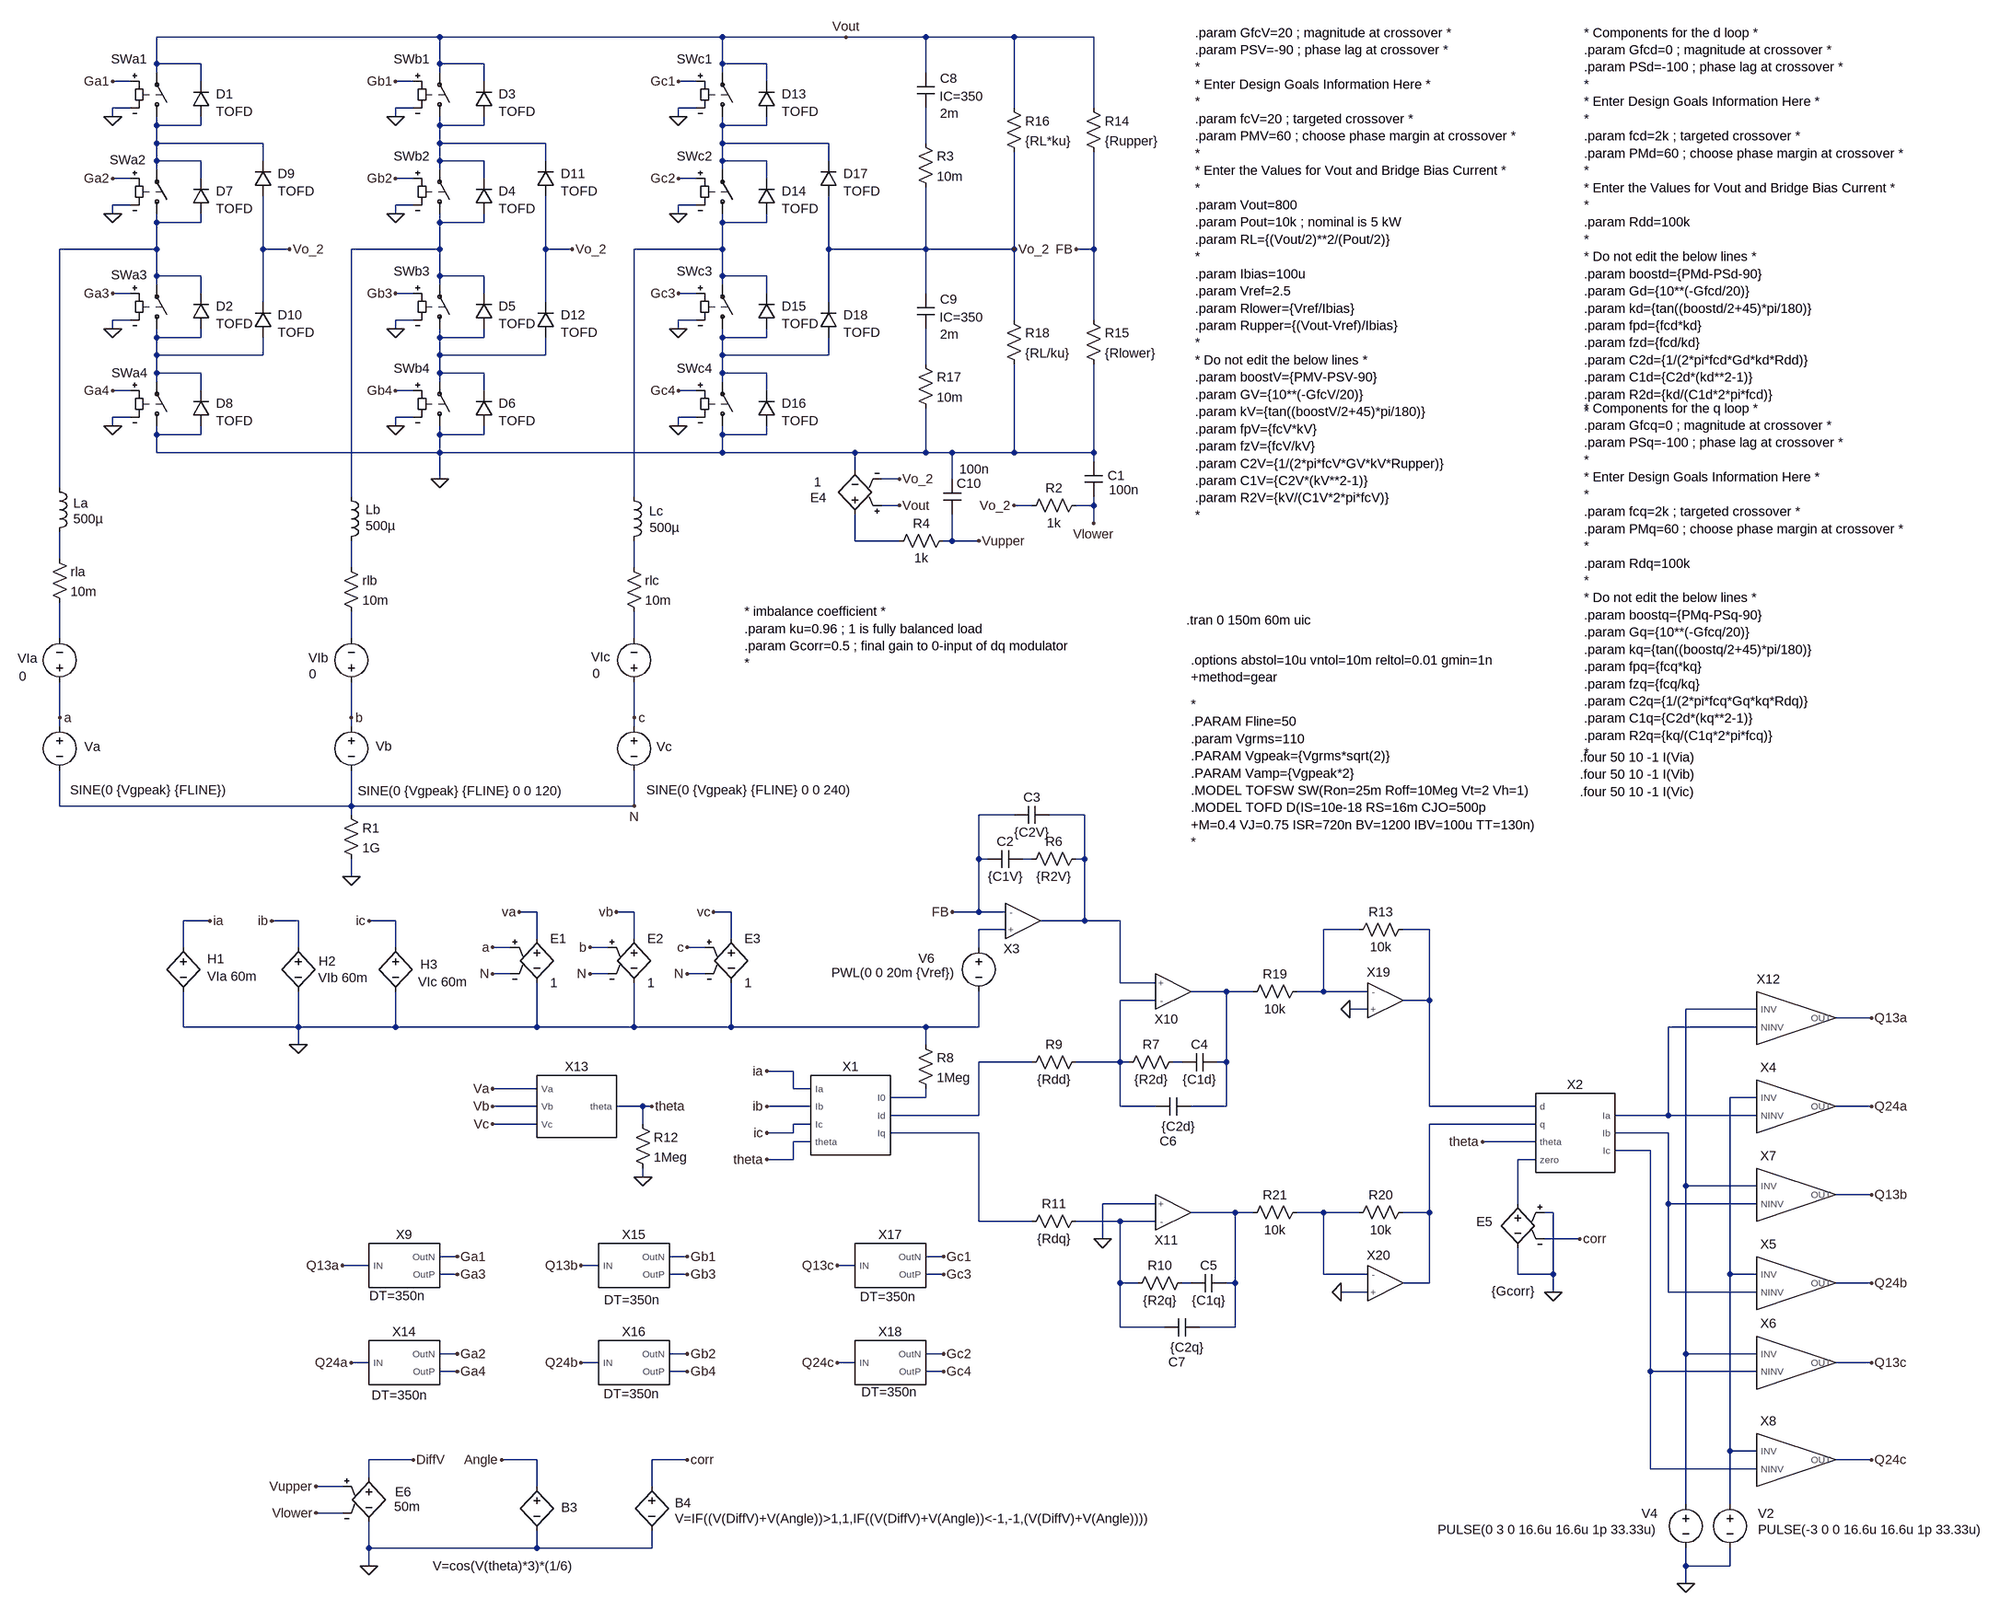
[diagram p0: schematic 3-phase NPC PFC with switches - balanced outputs.asc]
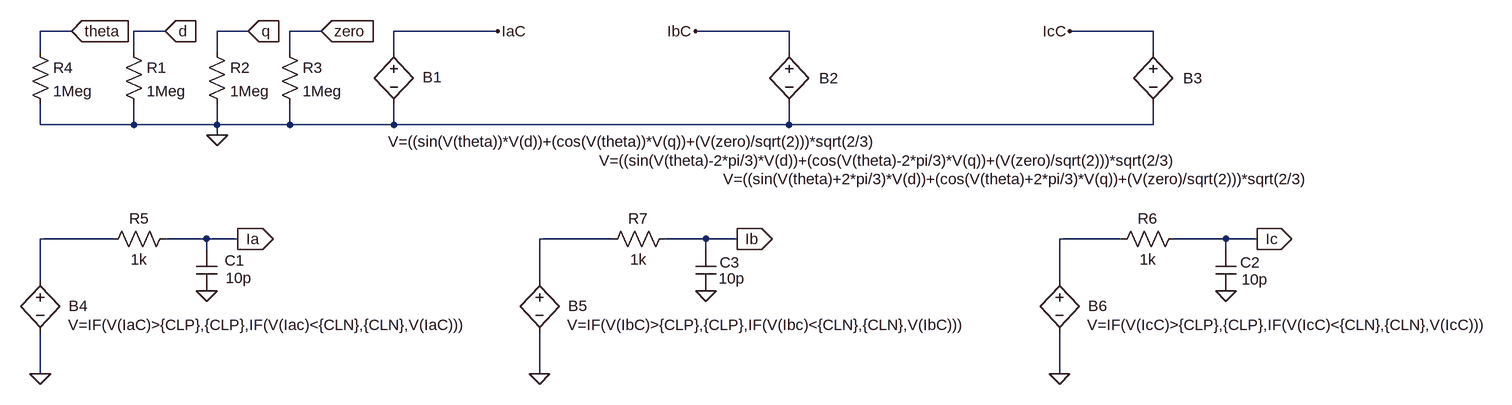
[diagram p1: sub-circuit inverse_dq0.asc]
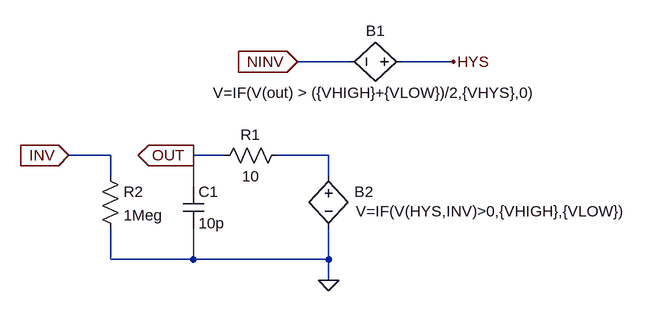
[diagram p2: sub-circuit comptof.asc]
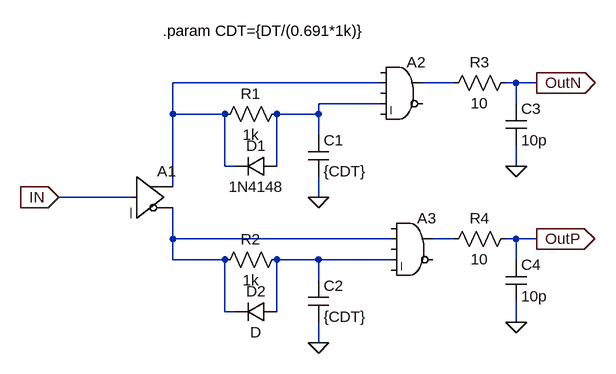
[diagram p3: sub-circuit dt_driver.asc]
3-phase NPC PFC with switches - balanced outputs.asc, the LTspice schematic file:
Version 4.1
SHEET 1 4820 2124
WIRE 496 -1056 -16 -1056
WIRE 1008 -1056 496 -1056
WIRE 1232 -1056 1008 -1056
WIRE 1376 -1056 1232 -1056
WIRE 1536 -1056 1376 -1056
WIRE 1680 -1056 1536 -1056
WIRE -16 -1008 -16 -1056
WIRE 64 -1008 -16 -1008
WIRE 496 -1008 496 -1056
WIRE 576 -1008 496 -1008
WIRE 1008 -1008 1008 -1056
WIRE 1088 -1008 1008 -1008
WIRE -16 -992 -16 -1008
WIRE 496 -992 496 -1008
WIRE 1008 -992 1008 -1008
WIRE 1376 -992 1376 -1056
WIRE -64 -976 -96 -976
WIRE 64 -976 64 -1008
WIRE 448 -976 416 -976
WIRE 576 -976 576 -1008
WIRE 960 -976 928 -976
WIRE 1088 -976 1088 -1008
WIRE -64 -928 -96 -928
WIRE 448 -928 416 -928
WIRE 960 -928 928 -928
WIRE 1536 -928 1536 -1056
WIRE 1680 -928 1680 -1056
WIRE -96 -912 -96 -928
WIRE 416 -912 416 -928
WIRE 928 -912 928 -928
WIRE -16 -896 -16 -912
WIRE 64 -896 64 -912
WIRE 64 -896 -16 -896
WIRE 496 -896 496 -912
WIRE 576 -896 576 -912
WIRE 576 -896 496 -896
WIRE 1008 -896 1008 -912
WIRE 1088 -896 1088 -912
WIRE 1088 -896 1008 -896
WIRE -16 -864 -16 -896
WIRE 176 -864 -16 -864
WIRE 496 -864 496 -896
WIRE 688 -864 496 -864
WIRE 1008 -864 1008 -896
WIRE 1200 -864 1008 -864
WIRE 1376 -864 1376 -928
WIRE -16 -832 -16 -864
WIRE 64 -832 -16 -832
WIRE 176 -832 176 -864
WIRE 496 -832 496 -864
WIRE 576 -832 496 -832
WIRE 688 -832 688 -864
WIRE 1008 -832 1008 -864
WIRE 1088 -832 1008 -832
WIRE 1200 -832 1200 -864
WIRE -16 -816 -16 -832
WIRE 496 -816 496 -832
WIRE 1008 -816 1008 -832
WIRE -64 -800 -96 -800
WIRE 64 -800 64 -832
WIRE 448 -800 416 -800
WIRE 576 -800 576 -832
WIRE 960 -800 928 -800
WIRE 1088 -800 1088 -832
WIRE -64 -752 -96 -752
WIRE 448 -752 416 -752
WIRE 960 -752 928 -752
WIRE -96 -736 -96 -752
WIRE 416 -736 416 -752
WIRE 928 -736 928 -752
WIRE -16 -720 -16 -736
WIRE 64 -720 64 -736
WIRE 64 -720 -16 -720
WIRE 496 -720 496 -736
WIRE 576 -720 576 -736
WIRE 576 -720 496 -720
WIRE 1008 -720 1008 -736
WIRE 1088 -720 1088 -736
WIRE 1088 -720 1008 -720
WIRE -16 -672 -16 -720
WIRE -16 -672 -192 -672
WIRE 176 -672 176 -768
WIRE 224 -672 176 -672
WIRE 496 -672 496 -720
WIRE 496 -672 336 -672
WIRE 688 -672 688 -768
WIRE 736 -672 688 -672
WIRE 1008 -672 1008 -720
WIRE 1008 -672 848 -672
WIRE 1200 -672 1200 -768
WIRE 1376 -672 1376 -784
WIRE 1376 -672 1200 -672
WIRE 1536 -672 1536 -848
WIRE 1536 -672 1376 -672
WIRE 1680 -672 1680 -848
WIRE 1680 -672 1648 -672
WIRE -16 -624 -16 -672
WIRE 64 -624 -16 -624
WIRE 496 -624 496 -672
WIRE 576 -624 496 -624
WIRE 1008 -624 1008 -672
WIRE 1088 -624 1008 -624
WIRE -16 -608 -16 -624
WIRE 496 -608 496 -624
WIRE 1008 -608 1008 -624
WIRE -64 -592 -96 -592
WIRE 64 -592 64 -624
WIRE 448 -592 416 -592
WIRE 576 -592 576 -624
WIRE 960 -592 928 -592
WIRE 1088 -592 1088 -624
WIRE 1376 -592 1376 -672
WIRE 176 -576 176 -672
WIRE 688 -576 688 -672
WIRE 1200 -576 1200 -672
WIRE -64 -544 -96 -544
WIRE 448 -544 416 -544
WIRE 960 -544 928 -544
WIRE 1536 -544 1536 -672
WIRE 1680 -544 1680 -672
WIRE -96 -528 -96 -544
WIRE 416 -528 416 -544
WIRE 928 -528 928 -544
WIRE -16 -512 -16 -528
WIRE 64 -512 64 -528
WIRE 64 -512 -16 -512
WIRE 496 -512 496 -528
WIRE 576 -512 576 -528
WIRE 576 -512 496 -512
WIRE 1008 -512 1008 -528
WIRE 1088 -512 1088 -528
WIRE 1088 -512 1008 -512
WIRE -16 -480 -16 -512
WIRE 176 -480 176 -512
WIRE 176 -480 -16 -480
WIRE 496 -480 496 -512
WIRE 688 -480 688 -512
WIRE 688 -480 496 -480
WIRE 1008 -480 1008 -512
WIRE 1200 -480 1200 -512
WIRE 1200 -480 1008 -480
WIRE 1376 -464 1376 -528
WIRE -16 -448 -16 -480
WIRE 64 -448 -16 -448
WIRE 496 -448 496 -480
WIRE 576 -448 496 -448
WIRE 1008 -448 1008 -480
WIRE 1088 -448 1008 -448
WIRE -16 -432 -16 -448
WIRE 496 -432 496 -448
WIRE 1008 -432 1008 -448
WIRE -64 -416 -96 -416
WIRE 64 -416 64 -448
WIRE 448 -416 416 -416
WIRE 576 -416 576 -448
WIRE 960 -416 928 -416
WIRE 1088 -416 1088 -448
WIRE -64 -368 -96 -368
WIRE 448 -368 416 -368
WIRE 960 -368 928 -368
WIRE -96 -352 -96 -368
WIRE 416 -352 416 -368
WIRE 928 -352 928 -368
WIRE -16 -336 -16 -352
WIRE 64 -336 64 -352
WIRE 64 -336 -16 -336
WIRE 496 -336 496 -352
WIRE 576 -336 576 -352
WIRE 576 -336 496 -336
WIRE 1008 -336 1008 -352
WIRE 1088 -336 1088 -352
WIRE 1088 -336 1008 -336
WIRE -16 -304 -16 -336
WIRE 496 -304 496 -336
WIRE 496 -304 -16 -304
WIRE 1008 -304 1008 -336
WIRE 1008 -304 496 -304
WIRE 1248 -304 1008 -304
WIRE 1376 -304 1376 -384
WIRE 1376 -304 1248 -304
WIRE 1424 -304 1376 -304
WIRE 1536 -304 1536 -464
WIRE 1536 -304 1424 -304
WIRE 1680 -304 1680 -464
WIRE 1680 -304 1536 -304
WIRE 1680 -288 1680 -304
WIRE 1248 -272 1248 -304
WIRE 496 -256 496 -304
WIRE 1328 -256 1296 -256
WIRE 1424 -256 1424 -304
WIRE -192 -240 -192 -672
WIRE 336 -224 336 -672
WIRE 848 -224 848 -672
WIRE 1328 -208 1296 -208
WIRE 1568 -208 1536 -208
WIRE 1680 -208 1680 -224
WIRE 1680 -208 1648 -208
WIRE 1680 -176 1680 -208
WIRE 1248 -144 1248 -192
WIRE 1328 -144 1248 -144
WIRE 1424 -144 1424 -192
WIRE 1424 -144 1408 -144
WIRE 1472 -144 1424 -144
WIRE -192 -112 -192 -160
WIRE 336 -96 336 -144
WIRE 848 -96 848 -144
WIRE -192 32 -192 -32
WIRE 336 32 336 -16
WIRE 848 32 848 -16
WIRE -192 176 -192 112
WIRE 336 176 336 112
WIRE 848 176 848 112
WIRE -192 192 -192 176
WIRE 336 192 336 176
WIRE 848 192 848 176
WIRE -192 336 -192 272
WIRE 336 336 336 272
WIRE 336 336 -192 336
WIRE 848 336 848 272
WIRE 848 336 336 336
WIRE 336 352 336 336
WIRE 1536 352 1472 352
WIRE 1664 352 1600 352
WIRE 1472 432 1472 352
WIRE 1488 432 1472 432
WIRE 1568 432 1552 432
WIRE 1664 432 1664 352
WIRE 1664 432 1648 432
WIRE 336 464 336 432
WIRE 672 528 640 528
WIRE 848 528 816 528
WIRE 1024 528 992 528
WIRE 1472 528 1472 432
WIRE 1472 528 1424 528
WIRE 1520 528 1472 528
WIRE 80 544 32 544
WIRE 240 544 192 544
WIRE 416 544 368 544
WIRE 1664 544 1664 432
WIRE 1664 544 1584 544
WIRE 1728 544 1664 544
WIRE 1520 560 1472 560
WIRE 2160 560 2096 560
WIRE 2288 560 2240 560
WIRE 672 576 672 528
WIRE 848 576 848 528
WIRE 1024 576 1024 528
WIRE 32 592 32 544
WIRE 240 592 240 544
WIRE 416 592 416 544
WIRE 624 592 592 592
WIRE 800 592 768 592
WIRE 976 592 944 592
WIRE 1472 592 1472 560
WIRE 624 640 592 640
WIRE 800 640 768 640
WIRE 976 640 944 640
WIRE 1728 656 1728 544
WIRE 1792 656 1728 656
WIRE 1920 672 1856 672
WIRE 1968 672 1920 672
WIRE 2096 672 2096 560
WIRE 2096 672 2048 672
WIRE 2176 672 2096 672
WIRE 1792 688 1728 688
WIRE 2288 688 2288 560
WIRE 2288 688 2240 688
WIRE 2176 704 2144 704
WIRE 2880 704 2752 704
WIRE 3088 720 3024 720
WIRE 32 736 32 672
WIRE 240 736 240 672
WIRE 240 736 32 736
WIRE 416 736 416 672
WIRE 416 736 240 736
WIRE 672 736 672 656
WIRE 672 736 416 736
WIRE 848 736 848 656
WIRE 848 736 672 736
WIRE 1024 736 1024 656
WIRE 1024 736 848 736
WIRE 1376 736 1024 736
WIRE 1472 736 1472 672
WIRE 1472 736 1376 736
WIRE 2880 736 2720 736
WIRE 240 768 240 736
WIRE 1376 768 1376 736
WIRE 1568 800 1472 800
WIRE 1728 800 1728 688
WIRE 1728 800 1648 800
WIRE 1744 800 1728 800
WIRE 1840 800 1824 800
WIRE 1920 800 1920 672
WIRE 1920 800 1904 800
WIRE 1136 816 1088 816
WIRE 672 848 592 848
WIRE 1136 848 1136 816
WIRE 1168 848 1136 848
WIRE 1376 864 1376 848
WIRE 1376 864 1312 864
WIRE 2880 864 2832 864
WIRE 672 880 592 880
WIRE 864 880 816 880
WIRE 880 880 864 880
WIRE 1168 880 1088 880
WIRE 1728 880 1728 800
WIRE 1792 880 1728 880
WIRE 1920 880 1920 800
WIRE 1920 880 1856 880
WIRE 2288 880 2288 688
WIRE 2480 880 2288 880
WIRE 3088 880 3024 880
WIRE 1472 896 1472 800
WIRE 1472 896 1312 896
WIRE 2720 896 2720 736
WIRE 2720 896 2624 896
WIRE 2880 896 2720 896
WIRE 672 912 592 912
WIRE 864 912 864 880
WIRE 1168 912 1136 912
WIRE 2480 912 2288 912
WIRE 1136 928 1136 912
WIRE 1136 928 1088 928
WIRE 1472 928 1312 928
WIRE 2720 928 2624 928
WIRE 1168 944 1136 944
WIRE 2480 944 2384 944
WIRE 2688 960 2624 960
WIRE 1136 976 1136 944
WIRE 1136 976 1088 976
WIRE 2480 976 2448 976
WIRE 864 1008 864 992
WIRE 2752 1024 2752 704
WIRE 2880 1024 2752 1024
WIRE 3088 1040 3024 1040
WIRE 1792 1056 1696 1056
WIRE 2448 1056 2448 976
WIRE 2720 1056 2720 928
WIRE 2880 1056 2720 1056
WIRE 1936 1072 1856 1072
WIRE 1968 1072 1936 1072
WIRE 2096 1072 2048 1072
WIRE 2160 1072 2096 1072
WIRE 2288 1072 2288 912
WIRE 2288 1072 2240 1072
WIRE 2512 1072 2496 1072
WIRE 1472 1088 1472 928
WIRE 1568 1088 1472 1088
WIRE 1728 1088 1648 1088
WIRE 1792 1088 1728 1088
WIRE 1696 1120 1696 1056
WIRE 2560 1120 2496 1120
WIRE 528 1152 496 1152
WIRE 944 1152 912 1152
WIRE 1408 1152 1376 1152
WIRE 368 1168 320 1168
WIRE 784 1168 752 1168
WIRE 1248 1168 1216 1168
WIRE 528 1184 496 1184
WIRE 944 1184 912 1184
WIRE 1408 1184 1376 1184
WIRE 2096 1184 2096 1072
WIRE 2176 1184 2096 1184
WIRE 2448 1184 2448 1136
WIRE 2512 1184 2512 1072
WIRE 2512 1184 2448 1184
WIRE 2832 1184 2832 864
WIRE 2880 1184 2832 1184
WIRE 1728 1200 1728 1088
WIRE 1760 1200 1728 1200
WIRE 1856 1200 1840 1200
WIRE 1936 1200 1936 1072
WIRE 1936 1200 1920 1200
WIRE 2288 1200 2288 1072
WIRE 2288 1200 2240 1200
WIRE 3088 1200 3024 1200
WIRE 2176 1216 2128 1216
WIRE 2512 1216 2512 1184
WIRE 2720 1216 2720 1056
WIRE 2880 1216 2720 1216
WIRE 1728 1280 1728 1200
WIRE 1808 1280 1728 1280
WIRE 1936 1280 1936 1200
WIRE 1936 1280 1872 1280
WIRE 528 1328 496 1328
WIRE 944 1328 912 1328
WIRE 1408 1328 1376 1328
WIRE 2752 1328 2752 1024
WIRE 2880 1328 2752 1328
WIRE 368 1344 336 1344
WIRE 784 1344 752 1344
WIRE 1248 1344 1216 1344
WIRE 3088 1344 3024 1344
WIRE 528 1360 496 1360
WIRE 944 1360 912 1360
WIRE 1408 1360 1376 1360
WIRE 2688 1360 2688 960
WIRE 2880 1360 2688 1360
WIRE 2832 1504 2832 1184
WIRE 2880 1504 2832 1504
WIRE 448 1520 368 1520
WIRE 672 1520 608 1520
WIRE 944 1520 880 1520
WIRE 3088 1520 3024 1520
WIRE 2688 1536 2688 1360
WIRE 2880 1536 2688 1536
WIRE 368 1552 368 1520
WIRE 320 1568 272 1568
WIRE 672 1568 672 1520
WIRE 880 1568 880 1520
WIRE 2752 1600 2752 1328
WIRE 2832 1600 2832 1504
WIRE 320 1616 272 1616
WIRE 368 1680 368 1632
WIRE 672 1680 672 1648
WIRE 672 1680 368 1680
WIRE 880 1680 880 1648
WIRE 880 1680 672 1680
WIRE 368 1712 368 1680
WIRE 2752 1712 2752 1680
WIRE 2832 1712 2832 1680
WIRE 2832 1712 2752 1712
WIRE 2752 1744 2752 1712
FLAG 336 464 0
FLAG 80 544 ia
FLAG 192 544 ib
FLAG 368 544 ic
FLAG -192 176 a
FLAG 336 176 b
FLAG 848 176 c
FLAG 240 768 0
FLAG 1232 -1056 Vout
FLAG 640 528 va
FLAG 848 336 N
FLAG 592 640 N
FLAG 592 592 a
FLAG 816 528 vb
FLAG 768 640 N
FLAG 768 592 b
FLAG 992 528 vc
FLAG 944 640 N
FLAG 944 592 c
FLAG 880 880 theta
FLAG 592 848 Va
FLAG 592 880 Vb
FLAG 592 912 Vc
FLAG 1088 816 ia
FLAG 1088 880 ib
FLAG 1088 928 ic
FLAG 1088 976 theta
FLAG 1424 528 FB
FLAG 1696 1120 0
FLAG 2384 944 theta
FLAG 2752 1744 0
FLAG 864 1008 0
FLAG -96 -352 0
FLAG -96 -528 0
FLAG -96 -736 0
FLAG -96 -912 0
FLAG 1648 -672 FB
FLAG 1536 -672 Vo_2
FLAG 224 -672 Vo_2
FLAG 416 -352 0
FLAG 416 -528 0
FLAG 416 -736 0
FLAG 416 -912 0
FLAG 736 -672 Vo_2
FLAG 928 -352 0
FLAG 928 -528 0
FLAG 928 -736 0
FLAG 928 -912 0
FLAG -96 -976 Ga1
FLAG -96 -800 Ga2
FLAG -96 -592 Ga3
FLAG -96 -416 Ga4
FLAG 416 -976 Gb1
FLAG 416 -800 Gb2
FLAG 416 -592 Gb3
FLAG 416 -416 Gb4
FLAG 928 -976 Gc1
FLAG 928 -800 Gc2
FLAG 928 -592 Gc3
FLAG 928 -416 Gc4
FLAG 528 1184 Ga3
FLAG 528 1152 Ga1
FLAG 528 1360 Ga4
FLAG 528 1328 Ga2
FLAG 3088 720 Q13a
FLAG 3088 880 Q24a
FLAG 3088 1040 Q13b
FLAG 3088 1200 Q24b
FLAG 3088 1344 Q13c
FLAG 3088 1520 Q24c
FLAG 320 1168 Q13a
FLAG 336 1344 Q24a
FLAG 944 1184 Gb3
FLAG 944 1152 Gb1
FLAG 944 1360 Gb4
FLAG 944 1328 Gb2
FLAG 752 1168 Q13b
FLAG 752 1344 Q24b
FLAG 1408 1184 Gc3
FLAG 1408 1152 Gc1
FLAG 1408 1360 Gc4
FLAG 1408 1328 Gc2
FLAG 1216 1168 Q13c
FLAG 1216 1344 Q24c
FLAG 496 -256 0
FLAG 2144 704 0
FLAG 2128 1216 0
FLAG 1536 -208 Vo_2
FLAG 1680 -176 Vlower
FLAG 1328 -256 Vo_2
FLAG 1328 -208 Vout
FLAG 1472 -144 Vupper
FLAG 272 1568 Vupper
FLAG 272 1616 Vlower
FLAG 368 1712 0
FLAG 448 1520 DiffV
FLAG 608 1520 Angle
FLAG 944 1520 corr
FLAG 2560 1120 corr
FLAG 2512 1216 0
SYMBOL voltage -192 176 R0
WINDOW 0 45 53 Left 2
WINDOW 3 19 131 Left 2
WINDOW 123 0 0 Left 0
WINDOW 39 0 0 Left 0
SYMATTR InstName Va
SYMATTR Value SINE(0 {Vgpeak} {FLINE})
SYMBOL voltage 336 176 R0
WINDOW 0 44 52 Left 2
WINDOW 3 12 133 Left 2
WINDOW 123 0 0 Left 0
WINDOW 39 0 0 Left 0
SYMATTR InstName Vb
SYMATTR Value SINE(0 {Vgpeak} {FLINE} 0 0 120)
SYMBOL voltage 848 176 R0
WINDOW 0 41 53 Left 2
WINDOW 3 22 131 Left 2
WINDOW 123 0 0 Left 0
WINDOW 39 0 0 Left 0
SYMATTR InstName Vc
SYMATTR Value SINE(0 {Vgpeak} {FLINE} 0 0 240)
SYMBOL res 320 336 R0
SYMATTR InstName R1
SYMATTR Value 1G
SYMBOL res -208 -128 R0
SYMATTR InstName rla
SYMATTR Value 10m
SYMBOL res 320 -112 R0
SYMATTR InstName rlb
SYMATTR Value 10m
SYMBOL res 832 -112 R0
SYMATTR InstName rlc
SYMATTR Value 10m
SYMBOL h 32 576 R0
WINDOW 0 43 37 Left 2
WINDOW 3 43 69 Left 2
SYMATTR InstName H1
SYMATTR Value VIa 60m
SYMBOL h 240 576 R0
WINDOW 0 37 41 Left 2
WINDOW 3 36 71 Left 2
SYMATTR InstName H2
SYMATTR Value VIb 60m
SYMBOL h 416 576 R0
WINDOW 0 45 47 Left 2
WINDOW 3 41 79 Left 2
SYMATTR InstName H3
SYMATTR Value VIc 60m
SYMBOL ind -208 -256 R0
WINDOW 0 41 44 Left 2
WINDOW 3 41 72 Left 2
SYMATTR InstName La
SYMATTR Value 500µ
SYMBOL ind 320 -240 R0
WINDOW 0 42 40 Left 2
WINDOW 3 42 69 Left 2
SYMATTR InstName Lb
SYMATTR Value 500µ
SYMBOL ind 832 -240 R0
WINDOW 0 43 42 Left 2
WINDOW 3 44 72 Left 2
SYMATTR InstName Lc
SYMATTR Value 500µ
SYMBOL voltage -192 128 R180
WINDOW 0 40 59 Left 2
WINDOW 3 60 27 Left 2
WINDOW 123 0 0 Left 0
WINDOW 39 0 0 Left 0
SYMATTR InstName VIa
SYMATTR Value 0
SYMBOL voltage 336 128 R180
WINDOW 0 41 60 Left 2
WINDOW 3 63 31 Left 2
WINDOW 123 0 0 Left 0
WINDOW 39 0 0 Left 0
SYMATTR InstName VIb
SYMATTR Value 0
SYMBOL voltage 848 128 R180
WINDOW 0 43 62 Left 2
WINDOW 3 62 32 Left 2
WINDOW 123 0 0 Left 0
WINDOW 39 0 0 Left 0
SYMATTR InstName VIc
SYMATTR Value 0
SYMBOL sw -16 -896 M180
WINDOW 3 47 44 Invisible 2
WINDOW 0 -83 120 Left 2
SYMATTR Value TOFSW
SYMATTR InstName SWa1
SYMBOL e 672 560 R0
SYMATTR InstName E1
SYMATTR Value 1
SYMBOL e 848 560 R0
SYMATTR InstName E2
SYMATTR Value 1
SYMBOL e 1024 560 R0
SYMATTR InstName E3
SYMATTR Value 1
SYMBOL res 1664 416 R90
WINDOW 0 0 56 VBottom 2
WINDOW 3 32 56 VTop 2
SYMATTR InstName R6
SYMATTR Value {R2V}
SYMBOL cap 1552 416 R90
WINDOW 0 0 32 VBottom 2
WINDOW 3 32 32 VTop 2
SYMATTR InstName C2
SYMATTR Value {C1V}
SYMBOL cap 1600 336 R90
WINDOW 0 0 32 VBottom 2
WINDOW 3 32 32 VTop 2
SYMATTR InstName C3
SYMATTR Value {C2V}
SYMBOL res 1728 816 R270
WINDOW 0 32 56 VTop 2
WINDOW 3 0 56 VBottom 2
SYMATTR InstName R7
SYMATTR Value {R2d}
SYMBOL cap 1840 816 R270
WINDOW 0 32 32 VTop 2
WINDOW 3 0 32 VBottom 2
SYMATTR InstName C4
SYMATTR Value {C1d}
SYMBOL cap 1792 896 R270
WINDOW 0 -63 23 VTop 2
WINDOW 3 -5 41 VBottom 2
SYMATTR InstName C6
SYMATTR Value {C2d}
SYMBOL res 1360 752 R0
SYMATTR InstName R8
SYMATTR Value 1Meg
SYMBOL res 1664 784 R90
WINDOW 0 0 56 VBottom 2
WINDOW 3 32 56 VTop 2
SYMATTR InstName R9
SYMATTR Value {Rdd}
SYMBOL res 1744 1216 R270
WINDOW 0 32 56 VTop 2
WINDOW 3 0 56 VBottom 2
SYMATTR InstName R10
SYMATTR Value {R2q}
SYMBOL cap 1856 1216 R270
WINDOW 0 32 32 VTop 2
WINDOW 3 0 32 VBottom 2
SYMATTR InstName C5
SYMATTR Value {C1q}
SYMBOL cap 1808 1296 R270
WINDOW 0 -63 23 VTop 2
WINDOW 3 -5 41 VBottom 2
SYMATTR InstName C7
SYMATTR Value {C2q}
SYMBOL res 1664 1072 R90
WINDOW 0 0 56 VBottom 2
WINDOW 3 32 56 VTop 2
SYMATTR InstName R11
SYMATTR Value {Rdq}
SYMBOL voltage 2752 1584 M0
WINDOW 123 0 0 Left 0
WINDOW 39 0 0 Left 0
WINDOW 0 51 33 Left 2
WINDOW 3 51 62 Left 2
SYMATTR InstName V4
SYMATTR Value PULSE(0 3 0 16.6u 16.6u 1p 33.33u)
SYMBOL res 848 896 R0
SYMATTR InstName R12
SYMATTR Value 1Meg
SYMBOL diode 48 -912 M180
WINDOW 0 43 41 Left 2
WINDOW 3 43 9 Left 2
SYMATTR InstName D1
SYMATTR Value TOFD
SYMBOL theta_sub 736 880 R0
SYMATTR InstName X13
SYMBOL dq0_sub 1232 896 R0
SYMATTR InstName X1
SYMBOL Inverse_dq0 2544 928 R0
SYMATTR InstName X2
SYMATTR SpiceLine CLP=2.9 CLN=-2.9
SYMBOL opampTOF 1584 528 R0
WINDOW 0 -52 82 Bottom 2
SYMATTR InstName X3
SYMATTR SpiceLine VHIGH=5 VLOW=100m
SYMBOL opampTOF 1856 688 M180
WINDOW 0 -44 -19 Bottom 2
SYMATTR InstName X10
SYMATTR SpiceLine VHIGH=5 VLOW=-5
SYMBOL opampTOF 1856 1088 M180
WINDOW 0 -44 -19 Bottom 2
SYMATTR InstName X11
SYMATTR SpiceLine VHIGH=5 VLOW=-5
SYMBOL COMPTOF 2944 720 R0
WINDOW 0 -42 -55 Bottom 2
SYMATTR InstName X12
SYMATTR SpiceLine VHIGH=5 VLOW=100m VHYS=10m
SYMBOL COMPTOF 2944 1040 R0
WINDOW 0 -42 -55 Bottom 2
SYMATTR InstName X7
SYMATTR SpiceLine VHIGH=5 VLOW=100m VHYS=10m
SYMBOL COMPTOF 2944 1520 R0
WINDOW 0 -42 -55 Bottom 2
SYMATTR InstName X8
SYMATTR SpiceLine VHIGH=5 VLOW=100m VHYS=10m
SYMBOL sw -16 -720 M180
WINDOW 3 47 44 Invisible 2
WINDOW 0 -85 114 Left 2
SYMATTR Value TOFSW
SYMATTR InstName SWa2
SYMBOL diode 48 -736 M180
WINDOW 0 43 41 Left 2
WINDOW 3 43 9 Left 2
SYMATTR InstName D7
SYMATTR Value TOFD
SYMBOL sw -16 -512 M180
WINDOW 3 47 44 Invisible 2
WINDOW 0 -83 113 Left 2
SYMATTR Value TOFSW
SYMATTR InstName SWa3
SYMBOL diode 48 -528 M180
WINDOW 0 43 41 Left 2
WINDOW 3 43 9 Left 2
SYMATTR InstName D2
SYMATTR Value TOFD
SYMBOL sw -16 -336 M180
WINDOW 3 47 44 Invisible 2
WINDOW 0 -82 112 Left 2
SYMATTR Value TOFSW
SYMATTR InstName SWa4
SYMBOL diode 48 -352 M180
WINDOW 0 43 41 Left 2
WINDOW 3 43 9 Left 2
SYMATTR InstName D8
SYMATTR Value TOFD
SYMBOL diode 160 -768 M180
WINDOW 0 43 41 Left 2
WINDOW 3 43 9 Left 2
SYMATTR InstName D9
SYMATTR Value TOFD
SYMBOL diode 160 -512 M180
WINDOW 0 43 41 Left 2
WINDOW 3 43 9 Left 2
SYMATTR InstName D10
SYMATTR Value TOFD
SYMBOL cap 1360 -992 R0
WINDOW 0 42 11 Left 2
WINDOW 3 42 74 Left 2
WINDOW 123 41 43 Left 2
SYMATTR InstName C8
SYMATTR Value 2m
SYMATTR Value2 IC=350
SYMBOL res 1360 -880 R0
SYMATTR InstName R3
SYMATTR Value 10m
SYMBOL res 1664 -944 R0
SYMATTR InstName R14
SYMATTR Value {Rupper}
SYMBOL res 1664 -560 R0
SYMATTR InstName R15
SYMATTR Value {Rlower}
SYMBOL res 1520 -944 R0
SYMATTR InstName R16
SYMATTR Value {RL*ku}
SYMBOL cap 1360 -592 R0
WINDOW 0 42 11 Left 2
WINDOW 3 42 74 Left 2
WINDOW 123 41 43 Left 2
SYMATTR InstName C9
SYMATTR Value 2m
SYMATTR Value2 IC=350
SYMBOL res 1360 -480 R0
SYMATTR InstName R17
SYMATTR Value 10m
SYMBOL res 1520 -560 R0
SYMATTR InstName R18
SYMATTR Value {RL/ku}
SYMBOL diode 560 -912 M180
WINDOW 0 43 41 Left 2
WINDOW 3 43 9 Left 2
SYMATTR InstName D3
SYMATTR Value TOFD
SYMBOL diode 560 -736 M180
WINDOW 0 43 41 Left 2
WINDOW 3 43 9 Left 2
SYMATTR InstName D4
SYMATTR Value TOFD
SYMBOL diode 560 -528 M180
WINDOW 0 43 41 Left 2
WINDOW 3 43 9 Left 2
SYMATTR InstName D5
SYMATTR Value TOFD
SYMBOL diode 560 -352 M180
WINDOW 0 43 41 Left 2
WINDOW 3 43 9 Left 2
SYMATTR InstName D6
SYMATTR Value TOFD
SYMBOL diode 672 -768 M180
WINDOW 0 43 41 Left 2
WINDOW 3 43 9 Left 2
SYMATTR InstName D11
SYMATTR Value TOFD
SYMBOL diode 672 -512 M180
WINDOW 0 43 41 Left 2
WINDOW 3 43 9 Left 2
SYMATTR InstName D12
SYMATTR Value TOFD
SYMBOL diode 1072 -912 M180
WINDOW 0 43 41 Left 2
WINDOW 3 43 9 Left 2
SYMATTR InstName D13
SYMATTR Value TOFD
SYMBOL diode 1072 -736 M180
WINDOW 0 43 41 Left 2
WINDOW 3 43 9 Left 2
SYMATTR InstName D14
SYMATTR Value TOFD
SYMBOL diode 1072 -528 M180
WINDOW 0 43 41 Left 2
WINDOW 3 43 9 Left 2
SYMATTR InstName D15
SYMATTR Value TOFD
SYMBOL diode 1072 -352 M180
WINDOW 0 43 41 Left 2
WINDOW 3 43 9 Left 2
SYMATTR InstName D16
SYMATTR Value TOFD
SYMBOL diode 1184 -768 M180
WINDOW 0 43 41 Left 2
WINDOW 3 43 9 Left 2
SYMATTR InstName D17
SYMATTR Value TOFD
SYMBOL diode 1184 -512 M180
WINDOW 0 43 41 Left 2
WINDOW 3 43 9 Left 2
SYMATTR InstName D18
SYMATTR Value TOFD
SYMBOL sw 496 -896 M180
WINDOW 3 47 44 Invisible 2
WINDOW 0 -83 120 Left 2
SYMATTR Value TOFSW
SYMATTR InstName SWb1
SYMBOL sw 496 -720 M180
WINDOW 3 47 44 Invisible 2
WINDOW 0 -83 120 Left 2
SYMATTR Value TOFSW
SYMATTR InstName SWb2
SYMBOL sw 496 -512 M180
WINDOW 3 47 44 Invisible 2
WINDOW 0 -83 120 Left 2
SYMATTR Value TOFSW
SYMATTR InstName SWb3
SYMBOL sw 496 -336 M180
WINDOW 3 47 44 Invisible 2
WINDOW 0 -83 120 Left 2
SYMATTR Value TOFSW
SYMATTR InstName SWb4
SYMBOL sw 1008 -896 M180
WINDOW 3 47 44 Invisible 2
WINDOW 0 -83 120 Left 2
SYMATTR Value TOFSW
SYMATTR InstName SWc1
SYMBOL sw 1008 -720 M180
WINDOW 3 47 44 Invisible 2
WINDOW 0 -83 120 Left 2
SYMATTR Value TOFSW
SYMATTR InstName SWc2
SYMBOL sw 1008 -512 M180
WINDOW 3 47 44 Invisible 2
WINDOW 0 -83 120 Left 2
SYMATTR Value TOFSW
SYMATTR InstName SWc3
SYMBOL sw 1008 -336 M180
WINDOW 3 47 44 Invisible 2
WINDOW 0 -83 120 Left 2
SYMATTR Value TOFSW
SYMATTR InstName SWc4
SYMBOL COMPTOF 2944 880 R0
WINDOW 0 -42 -55 Bottom 2
SYMATTR InstName X4
SYMATTR SpiceLine VHIGH=5 VLOW=100m VHYS=10m
SYMBOL COMPTOF 2944 1200 R0
WINDOW 0 -42 -55 Bottom 2
SYMATTR InstName X5
SYMATTR SpiceLine VHIGH=5 VLOW=100m VHYS=10m
SYMBOL voltage 2832 1584 R0
WINDOW 123 0 0 Left 0
WINDOW 39 0 0 Left 0
WINDOW 0 51 33 Left 2
WINDOW 3 51 62 Left 2
SYMATTR InstName V2
SYMATTR Value PULSE(-3 0 0 16.6u 16.6u 1p 33.33u)
SYMBOL COMPTOF 2944 1344 R0
WINDOW 0 -42 -55 Bottom 2
SYMATTR InstName X6
SYMATTR SpiceLine VHIGH=5 VLOW=100m VHYS=10m
SYMBOL DT_driver 432 1168 R0
WINDOW 39 -13 71 Bottom 2
SYMATTR SpiceLine DT=350n
SYMATTR InstName X9
SYMBOL DT_driver 432 1344 R0
WINDOW 39 -9 75 Bottom 2
SYMATTR SpiceLine DT=350n
SYMATTR InstName X14
SYMBOL DT_driver 848 1168 R0
WINDOW 39 -4 78 Bottom 2
SYMATTR SpiceLine DT=350n
SYMATTR InstName X15
SYMBOL DT_driver 848 1344 R0
WINDOW 39 -5 72 Bottom 2
SYMATTR SpiceLine DT=350n
SYMATTR InstName X16
SYMBOL DT_driver 1312 1168 R0
WINDOW 39 -5 72 Bottom 2
SYMATTR SpiceLine DT=350n
SYMATTR InstName X17
SYMBOL DT_driver 1312 1344 R0
WINDOW 39 -2 69 Bottom 2
SYMATTR SpiceLine DT=350n
SYMATTR InstName X18
SYMBOL voltage 1472 576 M0
WINDOW 0 80 36 Left 2
WINDOW 3 43 62 Left 2
WINDOW 123 0 0 Left 0
WINDOW 39 0 0 Left 0
SYMATTR InstName V6
SYMATTR Value PWL(0 0 20m {Vref})
SYMBOL opampTOF 2240 672 R0
WINDOW 0 -44 -19 Bottom 2
SYMATTR InstName X19
SYMATTR SpiceLine VHIGH=5 VLOW=-5
SYMBOL res 2256 544 R90
WINDOW 0 0 56 VBottom 2
WINDOW 3 32 56 VTop 2
SYMATTR InstName R13
SYMATTR Value 10k
SYMBOL res 2064 656 R90
WINDOW 0 0 56 VBottom 2
WINDOW 3 32 56 VTop 2
SYMATTR InstName R19
SYMATTR Value 10k
SYMBOL opampTOF 2240 1184 R0
WINDOW 0 -44 -19 Bottom 2
SYMATTR InstName X20
SYMATTR SpiceLine VHIGH=5 VLOW=-5
SYMBOL res 2256 1056 R90
WINDOW 0 0 56 VBottom 2
WINDOW 3 32 56 VTop 2
SYMATTR InstName R20
SYMATTR Value 10k
SYMBOL res 2064 1056 R90
WINDOW 0 0 56 VBottom 2
WINDOW 3 32 56 VTop 2
SYMATTR InstName R21
SYMATTR Value 10k
SYMBOL res 1664 -224 R90
WINDOW 0 0 56 VBottom 2
WINDOW 3 32 56 VTop 2
SYMATTR InstName R2
SYMATTR Value 1k
SYMBOL cap 1664 -288 R0
WINDOW 0 41 26 Left 2
WINDOW 3 44 52 Left 2
SYMATTR InstName C1
SYMATTR Value 100n
SYMBOL res 1424 -160 R90
WINDOW 0 0 56 VBottom 2
WINDOW 3 32 56 VTop 2
SYMATTR InstName R4
SYMATTR Value 1k
SYMBOL cap 1408 -256 R0
WINDOW 3 29 -18 Left 2
SYMATTR Value 100n
SYMATTR InstName C10
SYMBOL e 1248 -176 R180
WINDOW 0 52 46 Left 2
WINDOW 3 61 74 Left 2
SYMATTR InstName E4
SYMATTR Value 1
SYMBOL e 368 1536 R0
WINDOW 0 47 42 Left 2
WINDOW 3 46 69 Left 2
SYMATTR InstName E6
SYMATTR Value 50m
SYMBOL bv 672 1552 R0
WINDOW 0 44 54 Left 2
WINDOW 3 -188 160 Left 2
SYMATTR InstName B3
SYMATTR Value V=cos(V(theta)*3)*(1/6)
SYMBOL bv 880 1552 R0
WINDOW 0 42 46 Left 2
WINDOW 3 42 74 Left 2
SYMATTR InstName B4
SYMATTR Value V=IF((V(DiffV)+V(Angle))>1,1,IF((V(DiffV)+V(Angle))<-1,-1,(V(DiffV)+V(Angle))))
SYMBOL e 2448 1040 M0
WINDOW 0 46 49 Left 2
WINDOW 3 -30 175 Left 2
SYMATTR InstName E5
SYMATTR Value {Gcorr}
TEXT 1856 152 Left 2 !*\n.PARAM Fline=50\n.param Vgrms=110\n.PARAM Vgpeak={Vgrms*sqrt(2)}\n.PARAM Vamp={Vgpeak*2}\n.MODEL TOFSW SW(Ron=25m Roff=10Meg Vt=2 Vh=1)\n.MODEL TOFD D(IS=10e-18 RS=16m CJO=500p \n+M=0.4 VJ=0.75 ISR=720n BV=1200 IBV=100u TT=130n)\n*
TEXT 1848 0 Left 2 !.tran 0 150m 60m uic
TEXT 1864 -1064 Left 2 !.param GfcV=20 ; magnitude at crossover *\n.param PSV=-90 ; phase lag at crossover *\n*\n* Enter Design Goals Information Here *\n*\n.param fcV=20 ; targeted crossover *\n.param PMV=60 ; choose phase margin at crossover *\n*\n* Enter the Values for Vout and Bridge Bias Current *\n*\n.param Vout=800\n.param Pout=10k ; nominal is 5 kW\n.param RL={(Vout/2)**2/(Pout/2)}\n*\n.param Ibias=100u\n.param Vref=2.5\n.param Rlower={Vref/Ibias}\n.param Rupper={(Vout-Vref)/Ibias}\n*\n* Do not edit the below lines *\n.param boostV={PMV-PSV-90}\n.param GV={10**(-GfcV/20)}\n.param kV={tan((boostV/2+45)*pi/180)}\n.param fpV={fcV*kV}\n.param fzV={fcV/kV}\n.param C2V={1/(2*pi*fcV*GV*kV*Rupper)}\n.param C1V={C2V*(kV**2-1)}\n.param R2V={kV/(C1V*2*pi*fcV)}\n*
TEXT 2568 -1064 Left 2 !* Components for the d loop *\n.param Gfcd=0 ; magnitude at crossover *\n.param PSd=-100 ; phase lag at crossover *\n*\n* Enter Design Goals Information Here *\n*\n.param fcd=2k ; targeted crossover *\n.param PMd=60 ; choose phase margin at crossover *\n*\n* Enter the Values for Vout and Bridge Bias Current *\n*\n.param Rdd=100k\n*\n* Do not edit the below lines *\n.param boostd={PMd-PSd-90}\n.param Gd={10**(-Gfcd/20)}\n.param kd={tan((boostd/2+45)*pi/180)}\n.param fpd={fcd*kd}\n.param fzd={fcd/kd}\n.param C2d={1/(2*pi*fcd*Gd*kd*Rdd)}\n.param C1d={C2d*(kd**2-1)}\n.param R2d={kd/(C1d*2*pi*fcd)}\n*
TEXT 2568 -384 Left 2 !* Components for the q loop *\n.param Gfcq=0 ; magnitude at crossover *\n.param PSq=-100 ; phase lag at crossover *\n*\n* Enter Design Goals Information Here *\n*\n.param fcq=2k ; targeted crossover *\n.param PMq=60 ; choose phase margin at crossover *\n*\n.param Rdq=100k\n*\n* Do not edit the below lines *\n.param boostq={PMq-PSq-90}\n.param Gq={10**(-Gfcq/20)}\n.param kq={tan((boostq/2+45)*pi/180)}\n.param fpq={fcq*kq}\n.param fzq={fcq/kq}\n.param C2q={1/(2*pi*fcq*Gq*kq*Rdq)}\n.param C1q={C2d*(kq**2-1)}\n.param R2q={kq/(C1q*2*pi*fcq)}\n*
TEXT 2560 248 Left 2 !.four 50 10 -1 I(Via)\n.four 50 10 -1 I(Vib)\n.four 50 10 -1 I(Vic)
TEXT 1856 72 Left 2 !.options abstol=10u vntol=10m reltol=0.01 gmin=1n\n+method=gear
TEXT 1048 -16 Left 2 !* imbalance coefficient *\n.param ku=0.96 ; 1 is fully balanced load\n.param Gcorr=0.5 ; final gain to 0-input of dq modulator\n*

inverse_dq0.asc, the sub-circuit schematic file:
Version 4
SHEET 1 1804 980
WIRE -464 16 -512 16
WIRE -320 16 -368 16
WIRE -192 16 -240 16
WIRE -80 16 -128 16
WIRE 192 16 32 16
WIRE 640 16 496 16
WIRE 1200 16 1072 16
WIRE -512 48 -512 16
WIRE -368 48 -368 16
WIRE -240 48 -240 16
WIRE -128 48 -128 16
WIRE 32 48 32 16
WIRE 640 48 640 16
WIRE 1200 48 1200 16
WIRE -512 160 -512 128
WIRE -368 160 -368 128
WIRE -368 160 -512 160
WIRE -240 160 -240 128
WIRE -240 160 -368 160
WIRE -128 160 -128 128
WIRE -128 160 -240 160
WIRE 32 160 32 128
WIRE 32 160 -128 160
WIRE 640 160 640 128
WIRE 640 160 32 160
WIRE 1200 160 1200 128
WIRE 1200 160 640 160
WIRE -240 176 -240 160
WIRE -400 336 -512 336
WIRE -256 336 -320 336
WIRE -208 336 -256 336
WIRE 368 336 256 336
WIRE 512 336 448 336
WIRE 560 336 512 336
WIRE 1152 336 1056 336
WIRE 1312 336 1232 336
WIRE 1360 336 1312 336
WIRE -256 352 -256 336
WIRE 512 352 512 336
WIRE 1312 352 1312 336
WIRE -512 400 -512 336
WIRE 256 400 256 336
WIRE 1056 400 1056 336
WIRE -512 544 -512 480
WIRE 256 544 256 480
WIRE 1056 544 1056 480
FLAG -240 176 0
FLAG -320 16 d
IOPIN -320 16 In
FLAG -192 16 q
IOPIN -192 16 In
FLAG -80 16 zero
IOPIN -80 16 In
FLAG 192 16 IaC
FLAG 496 16 IbC
FLAG 1072 16 IcC
FLAG -464 16 theta
IOPIN -464 16 In
FLAG -208 336 Ia
IOPIN -208 336 Out
FLAG -512 544 0
FLAG 560 336 Ib
IOPIN 560 336 Out
FLAG 256 544 0
FLAG 1360 336 Ic
IOPIN 1360 336 Out
FLAG 1056 544 0
FLAG -256 416 0
FLAG 1312 416 0
FLAG 512 416 0
SYMBOL res -384 32 R0
SYMATTR InstName R1
SYMATTR Value 1Meg
SYMBOL res -256 32 R0
SYMATTR InstName R2
SYMATTR Value 1Meg
SYMBOL res -144 32 R0
SYMATTR InstName R3
SYMATTR Value 1Meg
SYMBOL bv 32 32 R0
WINDOW 0 44 55 Left 2
WINDOW 3 -9 154 Left 2
SYMATTR InstName B1
SYMATTR Value V=((sin(V(theta))*V(d))+(cos(V(theta))*V(q))+(V(zero)/sqrt(2)))*sqrt(2/3)
SYMBOL bv 640 32 R0
WINDOW 0 46 56 Left 2
WINDOW 3 -292 183 Left 2
SYMATTR InstName B2
SYMATTR Value V=((sin(V(theta)-2*pi/3)*V(d))+(cos(V(theta)-2*pi/3)*V(q))+(V(zero)/sqrt(2)))*sqrt(2/3)
SYMBOL res -528 32 R0
SYMATTR InstName R4
SYMATTR Value 1Meg
SYMBOL bv 1200 32 R0
WINDOW 0 46 56 Left 2
WINDOW 3 -661 212 Left 2
SYMATTR InstName B3
SYMATTR Value V=((sin(V(theta)+2*pi/3)*V(d))+(cos(V(theta)+2*pi/3)*V(q))+(V(zero)/sqrt(2)))*sqrt(2/3)
SYMBOL bv -512 384 R0
WINDOW 0 44 55 Left 2
WINDOW 3 43 84 Left 2
SYMATTR InstName B4
SYMATTR Value V=IF(V(IaC)>{CLP},{CLP},IF(V(Iac)<{CLN},{CLN},V(IaC)))
SYMBOL bv 256 384 R0
WINDOW 0 44 55 Left 2
WINDOW 3 43 84 Left 2
SYMATTR InstName B5
SYMATTR Value V=IF(V(IbC)>{CLP},{CLP},IF(V(Ibc)<{CLN},{CLN},V(IbC)))
SYMBOL bv 1056 384 R0
WINDOW 0 44 55 Left 2
WINDOW 3 43 84 Left 2
SYMATTR InstName B6
SYMATTR Value V=IF(V(IcC)>{CLP},{CLP},IF(V(IcC)<{CLN},{CLN},V(IcC)))
SYMBOL res -304 320 R90
WINDOW 0 0 56 VBottom 2
WINDOW 3 32 56 VTop 2
SYMATTR InstName R5
SYMATTR Value 1k
SYMBOL res 1248 320 R90
WINDOW 0 0 56 VBottom 2
WINDOW 3 32 56 VTop 2
SYMATTR InstName R6
SYMATTR Value 1k
SYMBOL res 464 320 R90
WINDOW 0 0 56 VBottom 2
WINDOW 3 32 56 VTop 2
SYMATTR InstName R7
SYMATTR Value 1k
SYMBOL cap -272 352 R0
WINDOW 0 44 17 Left 2
WINDOW 3 45 44 Left 2
SYMATTR InstName C1
SYMATTR Value 10p
SYMBOL cap 1296 352 R0
WINDOW 0 38 20 Left 2
WINDOW 3 40 46 Left 2
SYMATTR InstName C2
SYMATTR Value 10p
SYMBOL cap 496 352 R0
WINDOW 0 37 20 Left 2
WINDOW 3 36 45 Left 2
SYMATTR InstName C3
SYMATTR Value 10p

comptof.asc, the sub-circuit schematic file:
Version 4
SHEET 1 880 680
WIRE 64 192 -16 192
WIRE 224 192 144 192
WIRE -304 336 -368 336
WIRE -128 336 -176 336
WIRE 32 336 -48 336
WIRE -304 368 -304 336
WIRE 32 368 32 336
WIRE -176 384 -176 336
WIRE -304 496 -304 448
WIRE -176 496 -176 448
WIRE -176 496 -304 496
WIRE 32 496 32 448
WIRE 32 496 -176 496
WIRE 32 528 32 496
FLAG -16 192 NINV
IOPIN -16 192 In
FLAG 224 192 HYS
FLAG 32 528 0
FLAG -176 336 OUT
IOPIN -176 336 Out
FLAG -368 336 INV
IOPIN -368 336 In
SYMBOL bv 160 192 R90
WINDOW 0 -32 56 VBottom 2
WINDOW 3 32 56 VTop 2
SYMATTR InstName B1
SYMATTR Value V=IF(V(out) > ({VHIGH}+{VLOW})/2,{VHYS},0)
SYMBOL bv 32 352 R0
WINDOW 0 40 40 Left 2
WINDOW 3 42 70 Left 2
SYMATTR InstName B2
SYMATTR Value V=IF(V(HYS,INV)>0,{VHIGH},{VLOW})
SYMBOL res -32 320 R90
WINDOW 0 0 56 VBottom 2
WINDOW 3 32 56 VTop 2
SYMATTR InstName R1
SYMATTR Value 10
SYMBOL cap -192 384 R0
SYMATTR InstName C1
SYMATTR Value 10p
SYMBOL res -320 352 R0
SYMATTR InstName R2
SYMATTR Value 1Meg

dt_driver.asc, the sub-circuit schematic file:
Version 4
SHEET 1 880 680
WIRE 480 32 160 32
WIRE 592 32 544 32
WIRE 688 32 672 32
WIRE 720 32 688 32
WIRE 480 64 384 64
WIRE 688 64 688 32
WIRE 160 80 160 32
WIRE 240 80 160 80
WIRE 384 80 384 64
WIRE 384 80 320 80
WIRE 384 112 384 80
WIRE 240 160 240 80
WIRE 256 160 240 160
WIRE 320 160 320 80
WIRE 688 160 688 128
WIRE 160 192 160 80
WIRE 96 208 -16 208
WIRE 384 208 384 176
WIRE 160 272 160 224
WIRE 496 272 160 272
WIRE 592 272 560 272
WIRE 688 272 672 272
WIRE 720 272 688 272
WIRE 160 304 160 272
WIRE 240 304 160 304
WIRE 384 304 320 304
WIRE 496 304 384 304
WIRE 688 304 688 272
WIRE 384 336 384 304
WIRE 240 384 240 304
WIRE 256 384 240 384
WIRE 320 384 320 304
WIRE 688 400 688 368
WIRE 384 432 384 400
FLAG 384 208 0
FLAG 384 432 0
FLAG 720 32 OutN
IOPIN 720 32 Out
FLAG 720 272 OutP
IOPIN 720 272 Out
FLAG -16 208 IN
IOPIN -16 208 In
FLAG 688 160 0
FLAG 688 400 0
SYMBOL Digital\\buf 96 144 R0
SYMATTR InstName A1
SYMATTR SpiceLine Vhigh=5 Vlow=0 Ref=1.0
SYMBOL res 336 64 R90
WINDOW 0 0 56 VBottom 2
WINDOW 3 32 56 VTop 2
SYMATTR InstName R1
SYMATTR Value 1k
SYMBOL cap 368 112 R0
SYMATTR InstName C1
SYMATTR Value {CDT}
SYMBOL res 336 288 R90
WINDOW 0 0 56 VBottom 2
WINDOW 3 32 56 VTop 2
SYMATTR InstName R2
SYMATTR Value 1k
SYMBOL cap 368 336 R0
SYMATTR InstName C2
SYMATTR Value {CDT}
SYMBOL Digital\\and 512 -16 R0
SYMATTR InstName A2
SYMATTR SpiceLine Vhigh=5 Vlow=0 Ref=2.5
SYMBOL Digital\\and 528 224 R0
SYMATTR InstName A3
SYMATTR SpiceLine Vhigh=5 Vlow=0 Ref=2.5
SYMBOL diode 320 144 R90
WINDOW 0 0 32 VBottom 2
WINDOW 3 32 32 VTop 2
SYMATTR InstName D1
SYMATTR Value 1N4148
SYMBOL diode 320 368 R90
WINDOW 0 0 32 VBottom 2
WINDOW 3 32 32 VTop 2
SYMATTR InstName D2
SYMBOL res 688 16 R90
WINDOW 0 0 56 VBottom 2
WINDOW 3 32 56 VTop 2
SYMATTR InstName R3
SYMATTR Value 10
SYMBOL res 688 256 R90
WINDOW 0 0 56 VBottom 2
WINDOW 3 32 56 VTop 2
SYMATTR InstName R4
SYMATTR Value 10
SYMBOL cap 672 64 R0
SYMATTR InstName C3
SYMATTR Value 10p
SYMBOL cap 672 304 R0
SYMATTR InstName C4
SYMATTR Value 10p
TEXT 144 -48 Left 2 !.param CDT={DT/(0.691*1k)}

The netlist it stands for:
* 3-phase NPC PFC with switches - balanced outputs.asc
Va a N SINE(0 {Vgpeak} {FLINE})
Vb b N SINE(0 {Vgpeak} {FLINE} 0 0 120)
Vc c N SINE(0 {Vgpeak} {FLINE} 0 0 240)
R1 N 0 1G
rla N013 N016 10m
rlb N014 N017 10m
rlc N015 N018 10m
H1 ia 0 VIa 60m
H2 ib 0 VIb 60m
H3 ic 0 VIc 60m
La N005 N013 500µ
Lb N006 N014 500µ
Lc N007 N015 500µ
VIa a N016 0
VIb b N017 0
VIc c N018 0
SWa1 N001 Vout Ga1 0 TOFSW
E1 va 0 a N 1
E2 vb 0 b N 1
E3 vc 0 c N 1
R6 N019 N020 {R2V}
C2 N020 FB {C1V}
C3 N019 FB {C2V}
R7 N025 N029 {R2d}
C4 N029 N024 {C1d}
C6 N025 N024 {C2d}
R8 0 N030 1Meg
R9 N025 N028 {Rdd}
R10 N039 N040 {R2q}
C5 N040 N037 {C1q}
C7 N039 N037 {C2q}
R11 N039 N033 {Rdq}
V4 N026 0 PULSE(0 3 0 16.6u 16.6u 1p 33.33u)
R12 theta 0 1Meg
D1 N001 Vout TOFD
X§X13 va vb vc theta theta_sub  ; pins Va Vb Vc theta
X§X1 ia ib ic theta N030 N028 N033 dq0_sub  ; pins Ia Ib Ic theta I0 Id Iq
X§X2 N023 N032 theta N036 N027 N034 N035 inverse_dq0 params: CLP=2.9 CLN=-2.9
X§X3 FB N021 N019 opampTOF params: VHIGH=5 VLOW=100m  ; pins - + OUT
X§X10 N025 N019 N024 opampTOF params: VHIGH=5 VLOW=-5  ; pins - + OUT
X§X11 N039 0 N037 opampTOF params: VHIGH=5 VLOW=-5  ; pins - + OUT
X§X12 N026 N027 Q13a comptof params: VHIGH=5 VLOW=100m VHYS=10m
X§X7 N026 N034 Q13b comptof params: VHIGH=5 VLOW=100m VHYS=10m
X§X8 N031 N035 Q24c comptof params: VHIGH=5 VLOW=100m VHYS=10m
SWa2 N005 N001 Ga2 0 TOFSW
D7 N005 N001 TOFD
SWa3 N008 N005 Ga3 0 TOFSW
D2 N008 N005 TOFD
SWa4 0 N008 Ga4 0 TOFSW
D8 0 N008 TOFD
D9 Vo_2 N001 TOFD
D10 N008 Vo_2 TOFD
C8 Vout N004 2m IC=350
R3 N004 Vo_2 10m
R14 Vout FB {Rupper}
R15 FB 0 {Rlower}
R16 Vout Vo_2 {RL*ku}
C9 Vo_2 N011 2m IC=350
R17 N011 0 10m
R18 Vo_2 0 {RL/ku}
D3 N002 Vout TOFD
D4 N006 N002 TOFD
D5 N009 N006 TOFD
D6 0 N009 TOFD
D11 Vo_2 N002 TOFD
D12 N009 Vo_2 TOFD
D13 N003 Vout TOFD
D14 N007 N003 TOFD
D15 N010 N007 TOFD
D16 0 N010 TOFD
D17 Vo_2 N003 TOFD
D18 N010 Vo_2 TOFD
SWb1 N002 Vout Gb1 0 TOFSW
SWb2 N006 N002 Gb2 0 TOFSW
SWb3 N009 N006 Gb3 0 TOFSW
SWb4 0 N009 Gb4 0 TOFSW
SWc1 N003 Vout Gc1 0 TOFSW
SWc2 N007 N003 Gc2 0 TOFSW
SWc3 N010 N007 Gc3 0 TOFSW
SWc4 0 N010 Gc4 0 TOFSW
X§X4 N031 N027 Q24a comptof params: VHIGH=5 VLOW=100m VHYS=10m
X§X5 N031 N034 Q24b comptof params: VHIGH=5 VLOW=100m VHYS=10m
V2 N031 0 PULSE(-3 0 0 16.6u 16.6u 1p 33.33u)
X§X6 N026 N035 Q13c comptof params: VHIGH=5 VLOW=100m VHYS=10m
X§X9 Q13a Ga1 Ga3 dt_driver params: DT=350n
X§X14 Q24a Ga2 Ga4 dt_driver params: DT=350n
X§X15 Q13b Gb1 Gb3 dt_driver params: DT=350n
X§X16 Q24b Gb2 Gb4 dt_driver params: DT=350n
X§X17 Q13c Gc1 Gc3 dt_driver params: DT=350n
X§X18 Q24c Gc2 Gc4 dt_driver params: DT=350n
V6 N021 0 PWL(0 0 20m {Vref})
X§X19 N022 0 N023 opampTOF params: VHIGH=5 VLOW=-5  ; pins - + OUT
R13 N023 N022 10k
R19 N022 N024 10k
X§X20 N038 0 N032 opampTOF params: VHIGH=5 VLOW=-5  ; pins - + OUT
R20 N032 N038 10k
R21 N038 N037 10k
R2 Vlower Vo_2 1k
C1 0 Vlower 100n
R4 Vupper N012 1k
C10 0 Vupper 100n
E4 N012 0 Vout Vo_2 1
E6 DiffV 0 Vupper Vlower 50m
B3 Angle 0 V=cos(V(theta)*3)*(1/6)
B4 corr 0 V=IF((V(DiffV)+V(Angle))>1,1,IF((V(DiffV)+V(Angle))<-1,-1,(V(DiffV)+V(Angle))))
E5 N036 0 0 corr {Gcorr}

* block symbol definitions
.subckt inverse_dq0 d q theta zero Ia Ib Ic
R1 d 0 1Meg
R2 q 0 1Meg
R3 zero 0 1Meg
B1 IaC 0 V=((sin(V(theta))*V(d))+(cos(V(theta))*V(q))+(V(zero)/sqrt(2)))*sqrt(2/3)
B2 IbC 0 V=((sin(V(theta)-2*pi/3)*V(d))+(cos(V(theta)-2*pi/3)*V(q))+(V(zero)/sqrt(2)))*sqrt(2/3)
R4 theta 0 1Meg
B3 IcC 0 V=((sin(V(theta)+2*pi/3)*V(d))+(cos(V(theta)+2*pi/3)*V(q))+(V(zero)/sqrt(2)))*sqrt(2/3)
B4 N001 0 V=IF(V(IaC)>{CLP},{CLP},IF(V(Iac)<{CLN},{CLN},V(IaC)))
B5 N002 0 V=IF(V(IbC)>{CLP},{CLP},IF(V(Ibc)<{CLN},{CLN},V(IbC)))
B6 N003 0 V=IF(V(IcC)>{CLP},{CLP},IF(V(IcC)<{CLN},{CLN},V(IcC)))
R5 Ia N001 1k
R6 Ic N003 1k
R7 Ib N002 1k
C1 Ia 0 10p
C2 Ic 0 10p
C3 Ib 0 10p
.ends inverse_dq0

.subckt comptof INV NINV OUT
B1 HYS NINV V=IF(V(out) > ({VHIGH}+{VLOW})/2,{VHYS},0)
B2 N001 0 V=IF(V(HYS,INV)>0,{VHIGH},{VLOW})
R1 N001 OUT 10
C1 OUT 0 10p
R2 INV 0 1Meg
.ends comptof

.subckt dt_driver IN OutN OutP
A1 IN 0 0 0 0 N004 N001 0 BUF Vhigh=5 Vlow=0 Ref=1.0
R1 N003 N001 1k
C1 N003 0 {CDT}
R2 N006 N004 1k
C2 N006 0 {CDT}
A2 0 N001 0 N003 0 0 N002 0 AND Vhigh=5 Vlow=0 Ref=2.5
A3 0 N004 0 N006 0 0 N005 0 AND Vhigh=5 Vlow=0 Ref=2.5
D1 N003 N001 1N4148
D2 N006 N004 D
R3 OutN N002 10
R4 OutP N005 10
C3 OutN 0 10p
C4 OutP 0 10p
.param CDT={DT/(0.691*1k)}
.ends dt_driver

.model D D
.lib standard.dio
*
.PARAM Fline=50
.param Vgrms=110
.PARAM Vgpeak={Vgrms*sqrt(2)}
.PARAM Vamp={Vgpeak*2}
.MODEL TOFSW SW(Ron=25m Roff=10Meg Vt=2 Vh=1)
.MODEL TOFD D(IS=10e-18 RS=16m CJO=500p
+M=0.4 VJ=0.75 ISR=720n BV=1200 IBV=100u TT=130n)
*
.tran 0 150m 60m uic
.param GfcV=20 ; magnitude at crossover *
.param PSV=-90 ; phase lag at crossover *
*
* Enter Design Goals Information Here *
*
.param fcV=20 ; targeted crossover *
.param PMV=60 ; choose phase margin at crossover *
*
* Enter the Values for Vout and Bridge Bias Current *
*
.param Vout=800
.param Pout=10k ; nominal is 5 kW
.param RL={(Vout/2)**2/(Pout/2)}
*
.param Ibias=100u
.param Vref=2.5
.param Rlower={Vref/Ibias}
.param Rupper={(Vout-Vref)/Ibias}
*
* Do not edit the below lines *
.param boostV={PMV-PSV-90}
.param GV={10**(-GfcV/20)}
.param kV={tan((boostV/2+45)*pi/180)}
.param fpV={fcV*kV}
.param fzV={fcV/kV}
.param C2V={1/(2*pi*fcV*GV*kV*Rupper)}
.param C1V={C2V*(kV**2-1)}
.param R2V={kV/(C1V*2*pi*fcV)}
*
* Components for the d loop *
.param Gfcd=0 ; magnitude at crossover *
.param PSd=-100 ; phase lag at crossover *
*
* Enter Design Goals Information Here *
*
.param fcd=2k ; targeted crossover *
.param PMd=60 ; choose phase margin at crossover *
*
* Enter the Values for Vout and Bridge Bias Current *
*
.param Rdd=100k
*
* Do not edit the below lines *
.param boostd={PMd-PSd-90}
.param Gd={10**(-Gfcd/20)}
.param kd={tan((boostd/2+45)*pi/180)}
.param fpd={fcd*kd}
.param fzd={fcd/kd}
.param C2d={1/(2*pi*fcd*Gd*kd*Rdd)}
.param C1d={C2d*(kd**2-1)}
.param R2d={kd/(C1d*2*pi*fcd)}
*
* Components for the q loop *
.param Gfcq=0 ; magnitude at crossover *
.param PSq=-100 ; phase lag at crossover *
*
* Enter Design Goals Information Here *
*
.param fcq=2k ; targeted crossover *
.param PMq=60 ; choose phase margin at crossover *
*
.param Rdq=100k
*
* Do not edit the below lines *
.param boostq={PMq-PSq-90}
.param Gq={10**(-Gfcq/20)}
.param kq={tan((boostq/2+45)*pi/180)}
.param fpq={fcq*kq}
.param fzq={fcq/kq}
.param C2q={1/(2*pi*fcq*Gq*kq*Rdq)}
.param C1q={C2d*(kq**2-1)}
.param R2q={kq/(C1q*2*pi*fcq)}
*
.four 50 10 -1 I(Via)
.four 50 10 -1 I(Vib)
.four 50 10 -1 I(Vic)
.options abstol=10u vntol=10m reltol=0.01 gmin=1n
+method=gear
* imbalance coefficient *
.param ku=0.96 ; 1 is fully balanced load
.param Gcorr=0.5 ; final gain to 0-input of dq modulator
*
.backanno
.end